# EAGLE design 13+1 Port-Backplane (EAGLE 7.7.0)
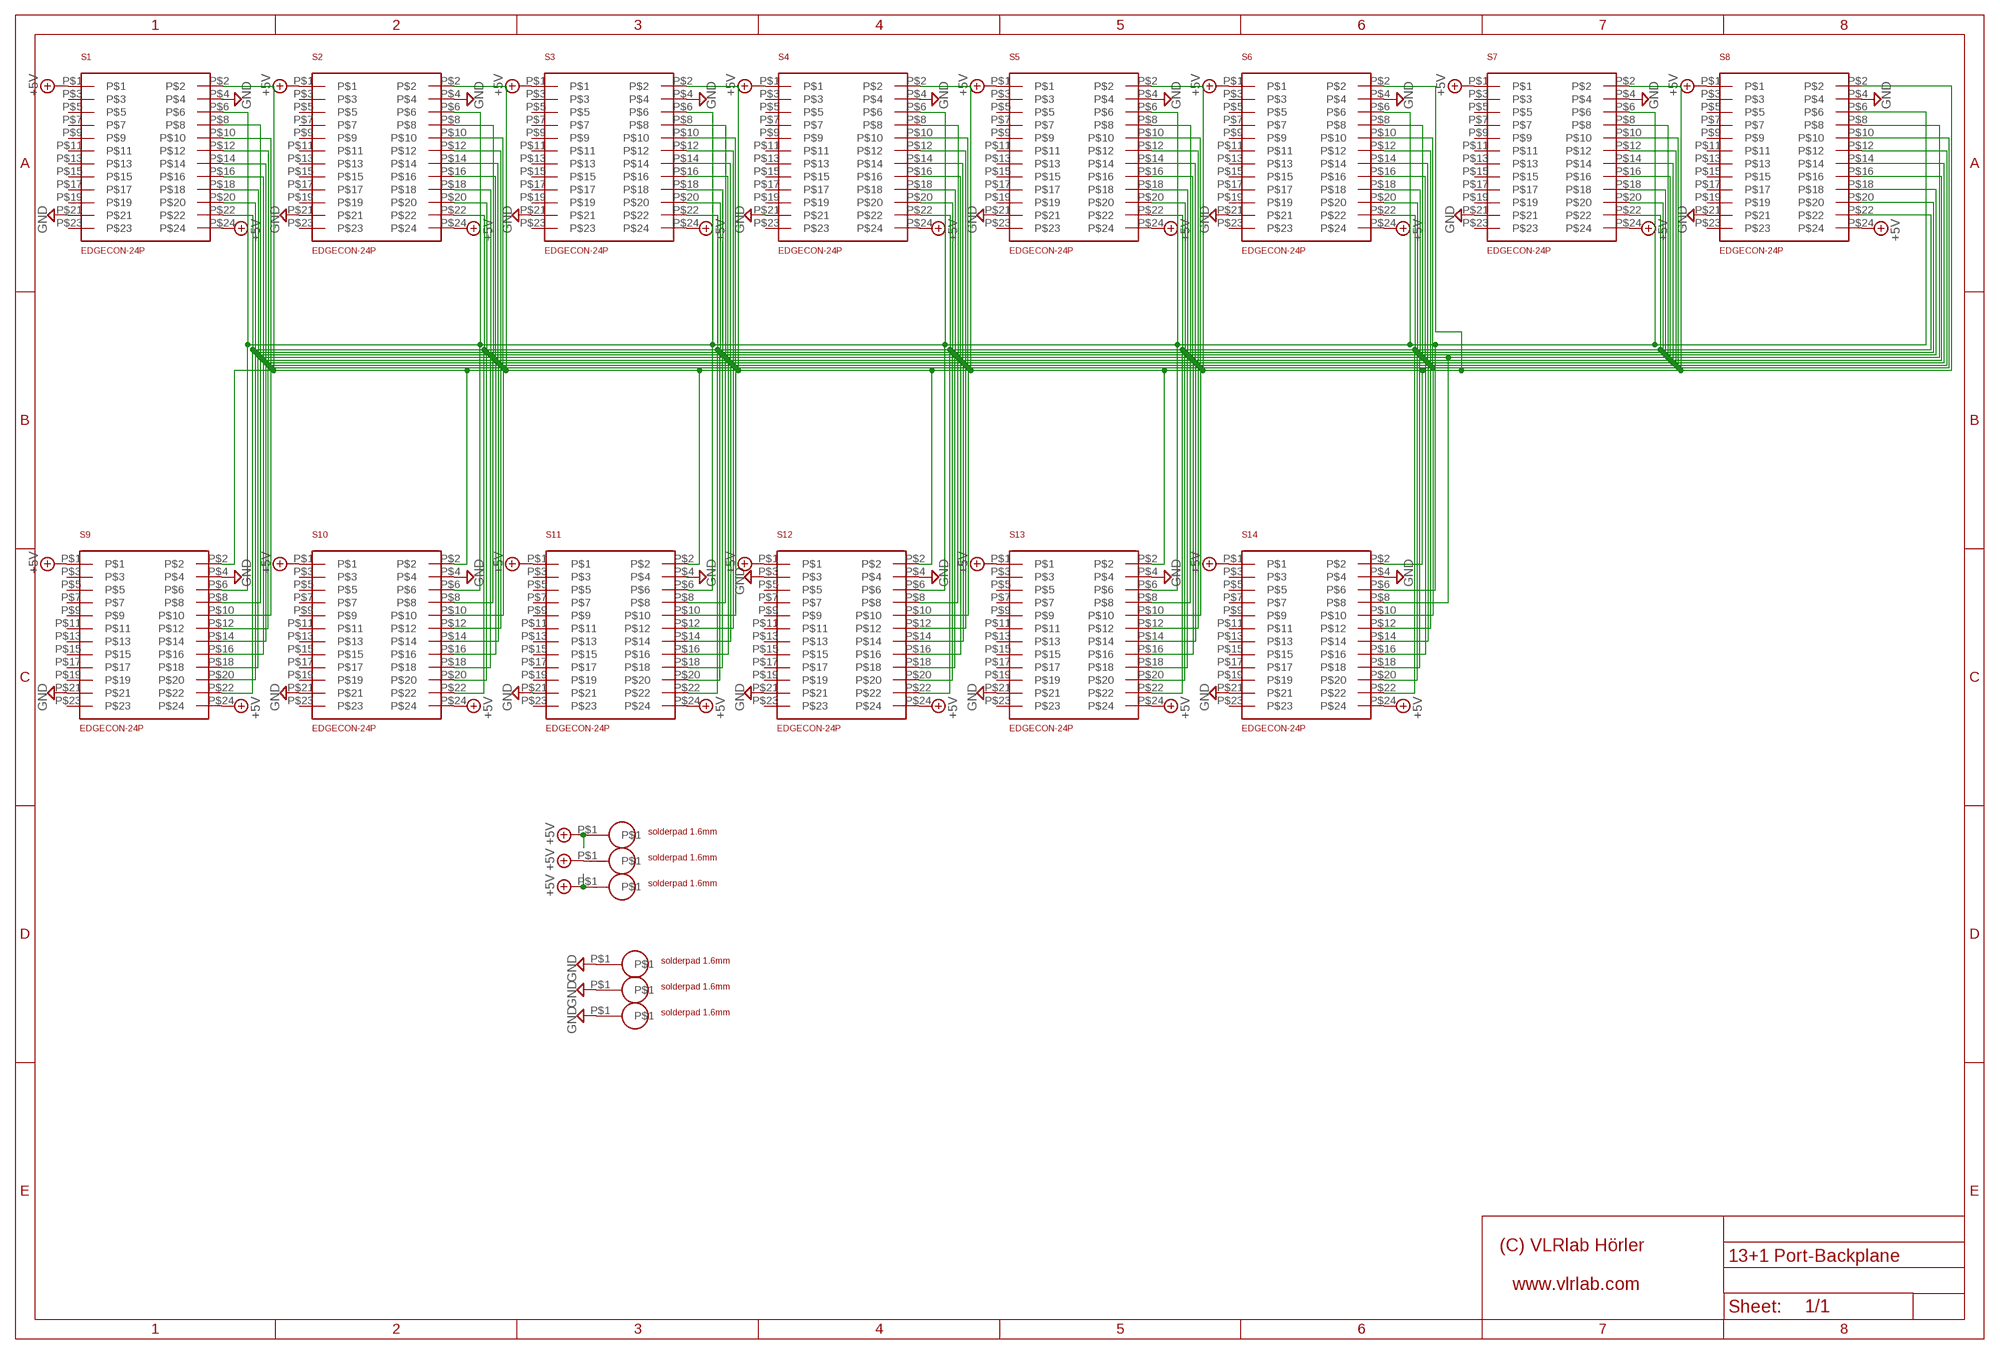
[diagram p0: schematic, sheet 1]

## Parts
S1  EDGECON-24P  [LEDSEE-BOARDCONN24PIN]
S2  EDGECON-24P  [LEDSEE-BOARDCONN24PIN]
S3  EDGECON-24P  [LEDSEE-BOARDCONN24PIN]
S4  EDGECON-24P  [LEDSEE-BOARDCONN24PIN]
S5  EDGECON-24P  [LEDSEE-BOARDCONN24PIN]
S6  EDGECON-24P  [LEDSEE-BOARDCONN24PIN]
S7  EDGECON-24P  [LEDSEE-BOARDCONN24PIN]
S8  EDGECON-24P  [LEDSEE-BOARDCONN24PIN]
S9  EDGECON-24P  [LEDSEE-BOARDCONN24PIN]
S10  EDGECON-24P  [LEDSEE-BOARDCONN24PIN]
S11  EDGECON-24P  [LEDSEE-BOARDCONN24PIN]
S12  EDGECON-24P  [LEDSEE-BOARDCONN24PIN]
S13  EDGECON-24P  [LEDSEE-BOARDCONN24PIN]
S14  EDGECON-24P  [LEDSEE-BOARDCONN24PIN]
U$6  SOLPAD-1,6MM  [SOLDERPAD1.5MM]
U$7  SOLPAD-1,6MM  [SOLDERPAD1.5MM]
U$8  SOLPAD-1,6MM  [SOLDERPAD1.5MM]
U$9  SOLPAD-1,6MM  [SOLDERPAD1.5MM]
U$10  SOLPAD-1,6MM  [SOLDERPAD1.5MM]
U$11  SOLPAD-1,6MM  [SOLDERPAD1.5MM]

## Nets
+5V [+5V]: S1.P$1 S1.P$24 S2.P$1 S2.P$24 S3.P$1 S3.P$24 S4.P$1 S4.P$24 S5.P$1 S5.P$24 S6.P$1 S6.P$24 S7.P$1 S7.P$24 S8.P$1 S8.P$24 S9.P$1 S9.P$24 S10.P$1 S10.P$24 S11.P$1 S11.P$24 S12.P$1 S12.P$24 S13.P$1 S13.P$24 S14.P$1 S14.P$24 U$6.P$1 U$7.P$1 U$9.P$1
GND: S1.P$4 S1.P$21 S2.P$4 S2.P$21 S3.P$4 S3.P$21 S4.P$4 S4.P$21 S5.P$4 S5.P$21 S6.P$4 S6.P$21 S7.P$4 S7.P$21 S8.P$4 S8.P$21 S9.P$4 S9.P$21 S10.P$4 S10.P$21 S11.P$4 S11.P$21 S12.P$3 S12.P$4 S12.P$21 S13.P$4 S13.P$21 S14.P$4 S14.P$21 U$8.P$1 U$10.P$1 U$11.P$1
PIN2: S1.P$2 S2.P$2 S3.P$2 S4.P$2 S5.P$2 S6.P$2 S7.P$2 S8.P$2 S9.P$2 S10.P$2 S11.P$2 S12.P$2 S13.P$2 S14.P$2
PIN6: S1.P$6 S2.P$6 S3.P$6 S4.P$6 S5.P$6 S6.P$6 S7.P$6 S8.P$6 S9.P$6 S10.P$6 S11.P$6 S12.P$6 S13.P$6 S14.P$6
PIN8: S1.P$8 S2.P$8 S3.P$8 S4.P$8 S5.P$8 S6.P$8 S7.P$8 S8.P$8 S9.P$8 S10.P$8 S11.P$8 S12.P$8 S13.P$8 S14.P$8
PIN10: S1.P$10 S2.P$10 S3.P$10 S4.P$10 S5.P$10 S6.P$10 S7.P$10 S8.P$10 S9.P$10 S10.P$10 S11.P$10 S12.P$10 S13.P$10 S14.P$10
PIN12: S1.P$12 S2.P$12 S3.P$12 S4.P$12 S5.P$12 S6.P$12 S7.P$12 S8.P$12 S9.P$12 S10.P$12 S11.P$12 S12.P$12 S13.P$12 S14.P$12
PIN14: S1.P$14 S2.P$14 S3.P$14 S4.P$14 S5.P$14 S6.P$14 S7.P$14 S8.P$14 S9.P$14 S10.P$14 S11.P$14 S12.P$14 S13.P$14 S14.P$14
PIN16: S1.P$16 S2.P$16 S3.P$16 S4.P$16 S5.P$16 S6.P$16 S7.P$16 S8.P$16 S9.P$16 S10.P$16 S11.P$16 S12.P$16 S13.P$16 S14.P$16
PIN18: S1.P$18 S2.P$18 S3.P$18 S4.P$18 S5.P$18 S6.P$18 S7.P$18 S8.P$18 S9.P$18 S10.P$18 S11.P$18 S12.P$18 S13.P$18 S14.P$18
PIN20: S1.P$20 S2.P$20 S3.P$20 S4.P$20 S5.P$20 S6.P$20 S7.P$20 S8.P$20 S9.P$20 S10.P$20 S11.P$20 S12.P$20 S13.P$20 S14.P$20
PIN22: S1.P$22 S2.P$22 S3.P$22 S4.P$22 S5.P$22 S6.P$22 S7.P$22 S8.P$22 S9.P$22 S10.P$22 S11.P$22 S12.P$22 S13.P$22 S14.P$22
Unconnected: S1.P$3 S1.P$5 S1.P$7 S1.P$9 S1.P$11 S1.P$13 S1.P$15 S1.P$17 S1.P$19 S1.P$23 S2.P$3 S2.P$5 S2.P$7 S2.P$9 S2.P$11 S2.P$13 S2.P$15 S2.P$17 S2.P$19 S2.P$23 S3.P$3 S3.P$5 S3.P$7 S3.P$9 S3.P$11 S3.P$13 S3.P$15 S3.P$17 S3.P$19 S3.P$23 S4.P$3 S4.P$5 S4.P$7 S4.P$9 S4.P$11 S4.P$13 S4.P$15 S4.P$17 S4.P$19 S4.P$23 S5.P$3 S5.P$5 S5.P$7 S5.P$9 S5.P$11 S5.P$13 S5.P$15 S5.P$17 S5.P$19 S5.P$23 S6.P$3 S6.P$5 S6.P$7 S6.P$9 S6.P$11 S6.P$13 S6.P$15 S6.P$17 S6.P$19 S6.P$23 S7.P$3 S7.P$5 S7.P$7 S7.P$9 S7.P$11 S7.P$13 S7.P$15 S7.P$17 S7.P$19 S7.P$23 S8.P$3 S8.P$5 S8.P$7 S8.P$9 S8.P$11 S8.P$13 S8.P$15 S8.P$17 S8.P$19 S8.P$23 S9.P$3 S9.P$5 S9.P$7 S9.P$9 S9.P$11 S9.P$13 S9.P$15 S9.P$17 S9.P$19 S9.P$23 S10.P$3 S10.P$5 S10.P$7 S10.P$9 S10.P$11 S10.P$13 S10.P$15 S10.P$17 S10.P$19 S10.P$23 S11.P$3 S11.P$5 S11.P$7 S11.P$9 S11.P$11 S11.P$13 S11.P$15 S11.P$17 S11.P$19 S11.P$23 S12.P$5 S12.P$7 S12.P$9 S12.P$11 S12.P$13 S12.P$15 S12.P$17 S12.P$19 S12.P$23 S13.P$3 S13.P$5 S13.P$7 S13.P$9 S13.P$11 S13.P$13 S13.P$15 S13.P$17 S13.P$19 S13.P$23 S14.P$3 S14.P$5 S14.P$7 S14.P$9 S14.P$11 S14.P$13 S14.P$15 S14.P$17 S14.P$19 S14.P$23

## Library data of the parts
S1-S14 = Ledsee:EDGECON-24P
U$6-U$11 = holes_Ivan:SOLPAD-1,6MM

## Net classes
0 default: width 0.61 mm
1 +5V: width 1.626 mm

## Board
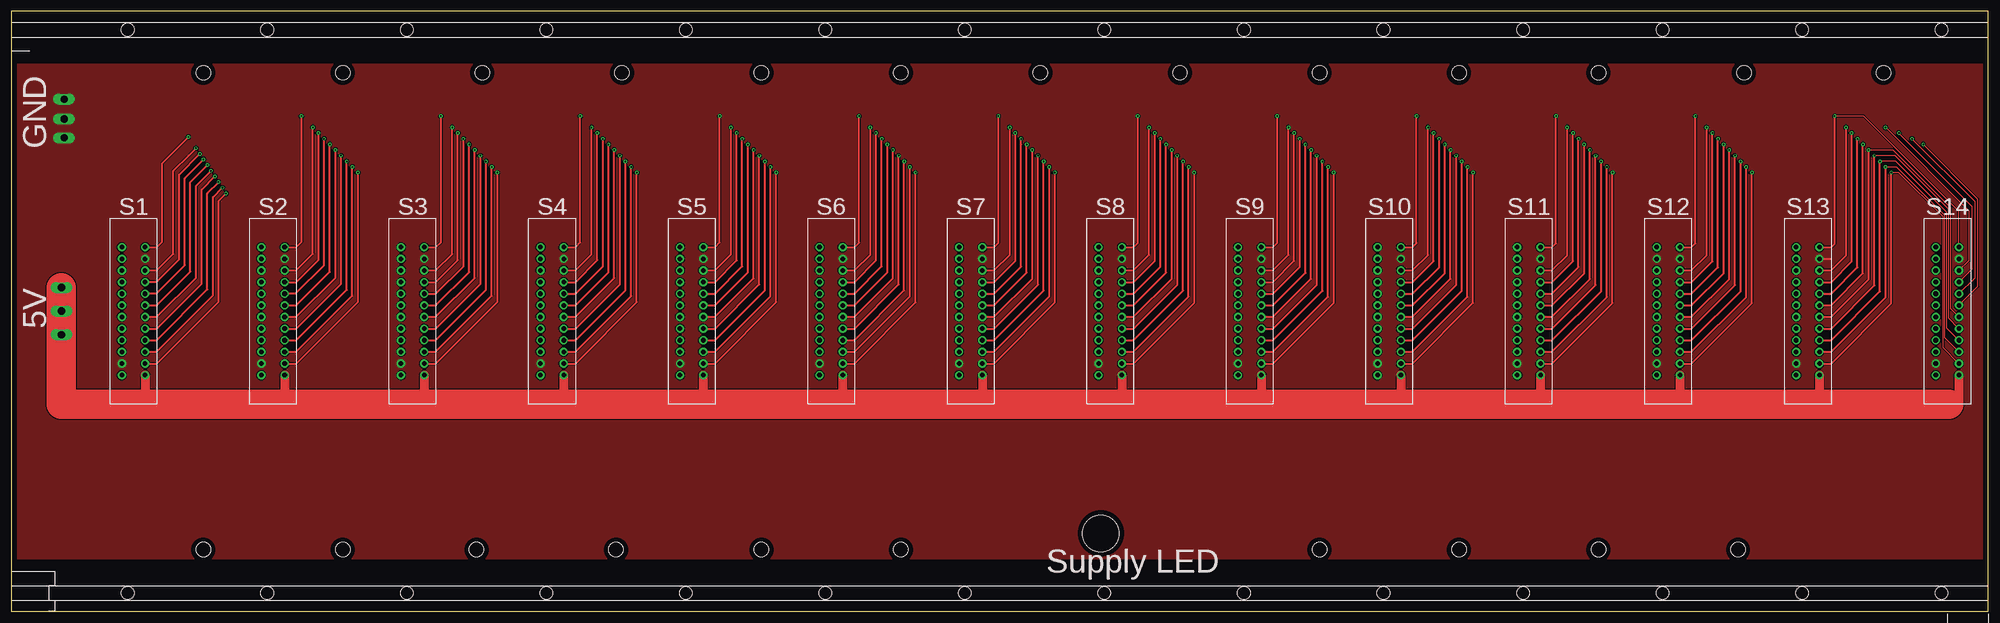
[diagram p1: board, top side]
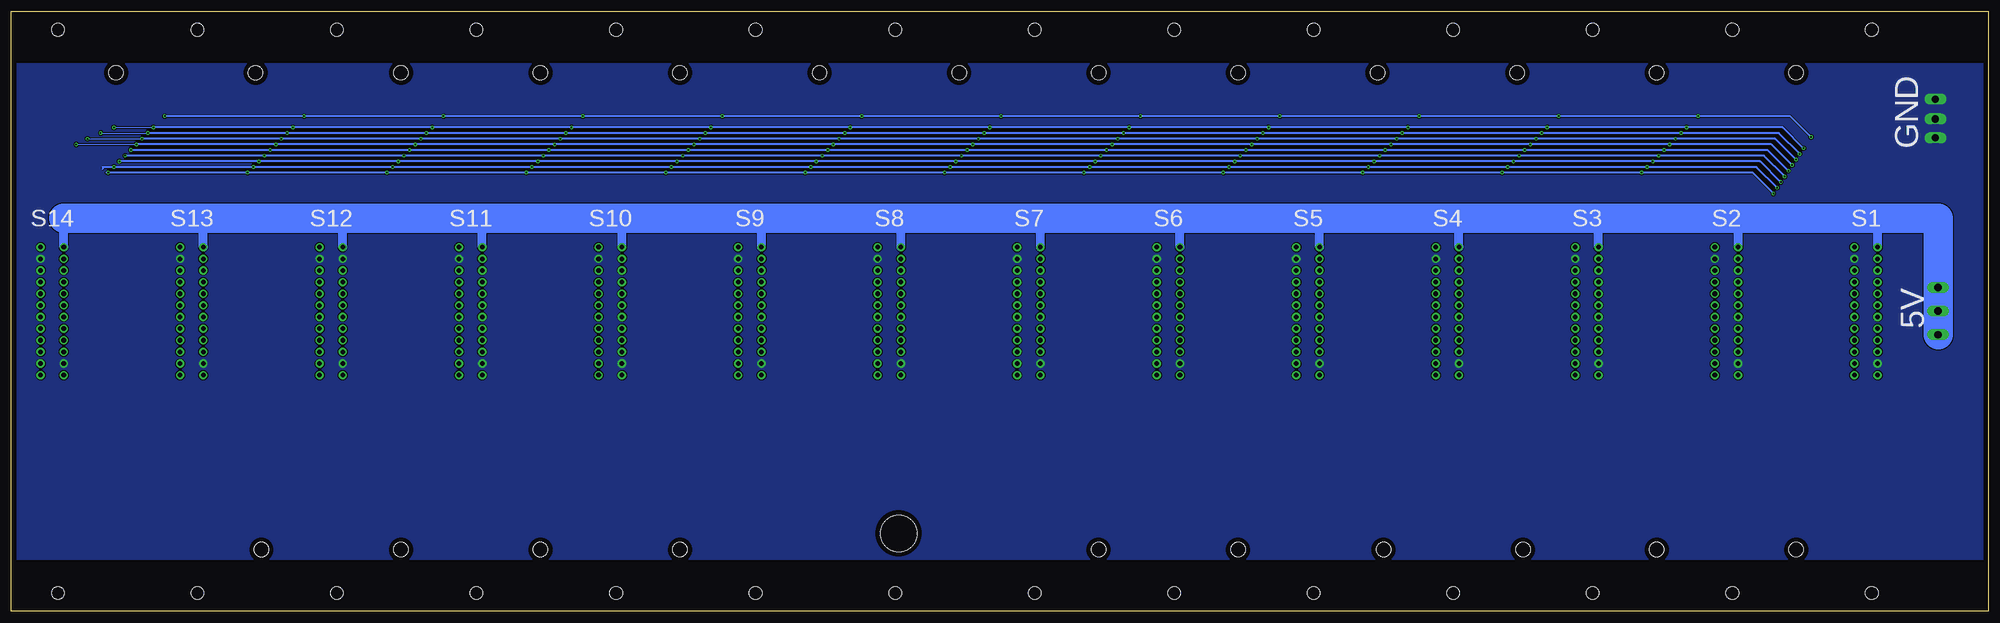
[diagram p2: board, bottom side, seen from below]

Size 431.8 x 131 mm. Coordinates in mm from the lower left corner, seen from the top.
Copper layers (1*16): Top 0.035mm / dielectric 1.5mm / Bottom 0.035mm
Design rules "default *": minimum track width 8mil, minimum drill 24mil, track to track 8mil, track to pad 8mil, pad to pad 8mil, via to via 8mil, smd to smd 8mil, copper to edge 40mil, drill to drill 8mil, minimum pad ring 10mil, minimum via ring 8mil, stop-mask expansion 4mil, vias tented up to drill 0mil, thermal gap 0mil
Holes 8 mm at 238,17
Holes 3.2 mm at 41.91,117.61 72.39,117.61 102.87,117.61 133.35,117.61 163.83,117.61 194.31,117.61 224.79,117.61 255.27,117.61 285.75,117.61 316.23,117.61 346.71,117.61 378.46,117.61 408.94,117.61 377.19,13.47 346.71,13.47 316.23,13.47 285.75,13.47 194.31,13.47 163.83,13.47 132.08,13.47 101.6,13.47 72.39,13.47 41.91,13.47

### Footprints (pad centres in the part's own frame; a part is rotated, then mirrored left to right if it is on the bottom)
LEDSEE-BOARDCONN24PIN = drill 1 pad 1.778: P$1 -2.54,13.97; P$2 2.54,13.97; P$3 -2.54,11.43; P$4 2.54,11.43; P$5 -2.54,8.89; P$6 2.54,8.89; P$7 -2.54,6.35; P$8 2.54,6.35; P$9 -2.54,3.81; P$10 2.54,3.81; P$11 -2.54,1.27; P$12 2.54,1.27; P$13 -2.54,-1.27; P$14 2.54,-1.27; P$15 -2.54,-3.81; P$16 2.54,-3.81; P$17 -2.54,-6.35; P$18 2.54,-6.35; P$19 -2.54,-8.89; P$20 2.54,-8.89; P$21 -2.54,-11.43; P$22 2.54,-11.43; P$23 -2.54,-13.97; P$24 2.54,-13.97
BAUGRUPPENTRAEGERBACKPLANEFULL@1 = hole 2.8: 25.4,127.5; 55.88,127.5; 86.36,127.5; 116.84,127.5; 147.32,127.5; 177.8,127.5; 208.28,127.5; 238.76,127.5; 269.24,127.5; 299.72,127.5; 330.2,127.5; 360.68,127.5; 391.16,127.5; 421.64,127.5; 25.4,4.5; 55.88,4.5; 86.36,4.5; 116.84,4.5; 147.32,4.5; 177.8,4.5; 208.28,4.5; 238.76,4.5; 269.24,4.5; 299.72,4.5; 330.2,4.5; 360.68,4.5; 391.16,4.5; 421.64,4.5
SOLDERPAD1.5MM = drill 1.6 long: P$1 0,0

### Placement (x,y rotation side)
S1  26.67,65.54 0 top
S2  57.15,65.54 0 top
S3  87.63,65.54 0 top
S4  118.11,65.54 0 top
S5  148.59,65.54 0 top
S6  179.07,65.54 0 top
S7  209.55,65.54 0 top
S8  240.03,65.54 0 top
S9  270.51,65.54 0 top
S10  300.99,65.54 0 top
S11  331.47,65.54 0 top
S12  361.95,65.54 0 top
S13  392.43,65.54 0 top
S14  422.91,65.54 0 top
U$2  [BAUGRUPPENTRAEGERBACKPLANEFULL@1]  0,-0.5 0 top
U$3  [VLRLAB]  401.32,13.47 0 top
U$4  [VLRLAB]  414.02,13.47 0 bottom
U$5  [BACKPLANE]  221.75,33.92 0 bottom
U$6  10.9,60.4 0 top
U$7  10.9,70.69 0 top
U$8  11.52,103.4 0 top
U$9  10.9,65.54 0 top
U$10  11.52,107.51 0 top
U$11  11.52,111.83 0 top
U$12  [BACKPLANE]  221.75,33.92 0 top

### Tracks (layer width: path | path; a pad name or v marks a point on that pad's centre or on a via)
+5V
  Top 1.93: 24.13,45.22 23.88,45.22 | S1.P$24 29.21,45.22 | S2.P$24 59.69,45.22 | S3.P$24 90.17,45.22 | S4.P$24 120.65,45.22 | S5.P$24 151.13,45.22 | S6.P$24 181.61,45.22 | S7.P$24 212.09,45.22 | S8.P$24 242.57,45.22 | S9.P$24 273.05,45.22 | S10.P$24 303.53,45.22 | S11.P$24 334.01,45.22 | S12.P$24 364.49,45.22 | S13.P$24 394.97,45.22 | S14.P$24 425.45,45.22 423.16,45.22
  Top 6.452: 23.88,45.22 24.13,45.22 | 24.13,45.22 29.21,45.22 54.61,45.22 59.69,45.22 85.09,45.22 90.17,45.22 115.57,45.22 120.65,45.22 146.05,45.22 151.13,45.22 176.53,45.22 181.61,45.22 207.01,45.22 212.09,45.22 237.49,45.22 242.57,45.22 267.97,45.22 273.05,45.22 298.45,45.22 303.53,45.22 328.93,45.22 334.01,45.22 359.41,45.22 364.49,45.22 389.89,45.22 394.97,45.22 420.37,45.22 423.16,45.22 | 24.13,45.22 23.88,45.22 | 23.88,45.22 10.84,45.22 10.9,45.22 U$6.P$1 | U$6.P$1 U$9.P$1 | U$9.P$1 10.9,69.86 | 10.9,69.86 U$7.P$1 | 10.9,69.86 U$9.P$1 | U$6.P$1 U$9.P$1
  Bottom 1.93: 419.87,85.86 419.89,85.86 | S14.P$1 420.37,85.86 | S13.P$1 389.89,85.86 | S12.P$1 359.41,85.86 | S11.P$1 328.93,85.86 | S10.P$1 298.45,85.86 | S9.P$1 267.97,85.86 | 242.57,85.35 242.57,85.86 | S8.P$1 237.49,85.86 | S7.P$1 207.01,85.86 | S6.P$1 176.53,85.86 | S5.P$1 146.05,85.86 | S4.P$1 115.57,85.86 | S3.P$1 85.09,85.86 | S2.P$1 54.61,85.86 | S1.P$1 24.13,85.86 26.42,85.86
  Bottom 6.452: 26.42,85.86 26.92,85.86 | 26.92,85.86 29.21,85.86 54.61,85.86 59.69,85.86 85.09,85.86 90.17,85.86 115.57,85.86 120.65,85.86 146.05,85.86 151.13,85.86 176.53,85.86 181.61,85.86 207.01,85.86 212.09,85.86 237.49,85.86 242.57,85.86 267.97,85.86 273.05,85.86 298.45,85.86 303.53,85.86 328.93,85.86 334.01,85.86 359.41,85.86 364.49,85.86 389.89,85.86 394.97,85.86 419.87,85.86 | 419.87,85.86 419.89,85.86 | 419.89,85.86 420.37,85.86 419.89,85.86 | 419.89,85.86 419.87,85.86 | 26.92,85.86 10.84,85.86 10.9,85.86 U$6.P$1
GND
  Top 0.406: S13.P$4 397.51,76.97
  pour Top: 1,11.5 1,119.5 431,119.5 431,11.5
  pour Bottom: 1,11.5 1,119.5 431,119.5 431,11.5
PIN2  (via drill 0.33)
  Top 0.203: S14.P$2 425.45,87.37 404.69,108.13 v398.31,108.13
  Top 0.406: S1.P$2 31.75,79.51 32.92,80.68 32.92,97.84 v38.68,103.6 | S2.P$2 62.23,79.51 63.37,80.65 v63.37,108.13 | S3.P$2 92.71,79.51 93.82,80.62 v93.82,108.13 | S4.P$2 123.19,79.51 124.27,80.59 v124.27,108.13 | S5.P$2 153.67,79.51 154.72,80.56 v154.72,108.13 | S6.P$2 184.15,79.51 185.17,80.53 v185.17,108.13 | S7.P$2 214.63,79.51 215.62,80.5 v215.62,108.13 | S8.P$2 245.11,79.51 246.06,80.47 v246.06,108.13 | S9.P$2 275.59,79.51 276.51,80.44 v276.51,108.13 | S10.P$2 306.07,79.51 306.96,80.4 v306.96,108.13 | S11.P$2 336.55,79.51 337.41,80.37 v337.41,108.13 | S12.P$2 367.03,79.51 367.86,80.34 v367.86,108.13 | S13.P$2 397.51,79.51 398.31,80.31 v398.31,108.13
  Bottom 0.406: v38.68,103.6 43.2,108.13 v63.37,108.13 v93.82,108.13 v124.27,108.13 v154.72,108.13 v185.17,108.13 v215.62,108.13 v246.06,108.13 v276.51,108.13 v306.96,108.13 v337.41,108.13 v367.86,108.13 v398.31,108.13
PIN6  (via drill 0.33)
  Top 0.203: S14.P$6 427.73,76.71 427.73,87.35 v409.42,105.66 | v409.42,105.66
  Top 0.406: S1.P$6 31.75,74.43 35.39,78.07 35.39,96.2 38.68,99.49 | S2.P$6 62.23,74.43 65.84,78.04 v65.84,105.66 | S3.P$6 92.71,74.43 96.29,78.01 v96.29,105.66 | S4.P$6 123.19,74.43 126.74,77.98 v126.74,105.66 | S5.P$6 153.67,74.43 157.19,77.94 v157.19,105.66 | S6.P$6 184.15,74.43 187.63,77.92 v187.63,105.66 | S7.P$6 214.63,74.43 218.08,77.88 v218.08,105.66 | S8.P$6 245.11,74.43 248.53,77.85 v248.53,105.66 | S9.P$6 275.59,74.43 278.98,77.82 v278.98,105.66 | S10.P$6 306.07,74.43 309.43,77.79 v309.43,105.66 | S11.P$6 336.55,74.43 339.88,77.76 v339.88,105.66 | S12.P$6 367.03,74.43 370.33,77.73 v370.33,105.66 | S13.P$6 397.51,74.43 400.78,77.7 v400.78,105.66 | 38.68,99.49 | 38.68,99.49 v40.33,101.14
  Bottom 0.203: v409.42,105.66 v400.78,105.66
  Bottom 0.406: v40.33,101.14 | v40.33,101.14 44.85,105.66 v65.84,105.66 v96.29,105.66 v126.74,105.66 v157.19,105.66 v187.63,105.66 v218.08,105.66 v248.53,105.66 v278.98,105.66 v309.43,105.66 v339.88,105.66 v370.33,105.66 v400.78,105.66
PIN8  (via drill 0.33)
  Top 0.203: S14.P$8 428.35,74.79 428.35,88.38 v412.3,104.43 | v412.3,104.43
  Top 0.406: S10.P$8 306.07,71.89 310.67,76.49 v310.67,104.43 | S1.P$8 29.24,71.92 31.68,71.92 36.62,76.86 36.62,95.38 | 36.62,95.38 | 36.62,95.38 v41.15,99.9 | S2.P$8 62.23,71.89 67.07,76.73 v67.07,104.43 | S3.P$8 92.71,71.89 97.52,76.7 v97.52,104.43 | S4.P$8 123.19,71.89 127.97,76.67 v127.97,104.43 | S5.P$8 153.67,71.89 158.42,76.64 v158.42,104.43 | S6.P$8 184.15,71.89 188.87,76.61 v188.87,104.43 | S7.P$8 214.63,71.89 219.32,76.58 v219.32,104.43 | S8.P$8 245.11,71.89 249.77,76.55 v249.77,104.43 | S9.P$8 275.59,71.89 280.22,76.52 v280.22,104.43 | S11.P$8 336.55,71.89 341.12,76.46 v341.12,104.43 | S12.P$8 367.03,71.89 371.57,76.43 v371.57,104.43 | S13.P$8 397.51,71.89 402.02,76.4 v402.02,104.43
  Bottom 0.203: v412.3,104.43 v402.02,104.43
  Bottom 0.406: v41.15,99.9 45.67,104.43 v67.07,104.43 v97.52,104.43 v127.97,104.43 v158.42,104.43 v188.87,104.43 v219.32,104.43 v249.77,104.43 v280.22,104.43 v310.67,104.43 v341.12,104.43 v371.57,104.43 v402.02,104.43
PIN10  (via drill 0.33)
  Top 0.203: S14.P$10 428.97,72.87 428.97,89.41 v415.18,103.19
  Top 0.406: S1.P$10 29.31,69.45 31.68,69.45 37.86,75.62 37.86,94.55 v41.97,98.67 | S2.P$10 59.79,69.45 62.13,69.45 68.31,75.62 v68.31,103.19 | S3.P$10 92.71,69.35 98.75,75.39 v98.75,103.19 | S4.P$10 123.19,69.35 129.21,75.36 129.21,101.96 v129.21,103.19 | S5.P$10 153.67,69.35 159.65,75.33 v159.65,103.19 | S6.P$10 184.15,69.35 190.1,75.3 v190.1,103.19 | S7.P$10 214.63,69.35 220.55,75.27 220.55,101.96 v220.55,103.19 | S8.P$10 245.11,69.35 251,75.24 v251,103.19 | S9.P$10 275.59,69.35 281.45,75.21 v281.45,103.19 | S10.P$10 306.07,69.35 311.9,75.18 v311.9,103.19 | S11.P$10 336.55,69.35 342.35,75.15 v342.35,103.19 | S12.P$10 367.03,69.35 372.8,75.12 v372.8,103.19 | S13.P$10 397.51,69.35 403.25,75.09 v403.25,103.19
  Bottom 0.203: v415.18,103.19 v403.25,103.19
  Bottom 0.406: v41.97,98.67 | v41.97,98.67 46.5,103.19 v68.31,103.19 v98.75,103.19 v129.21,103.19 v159.65,103.19 v190.1,103.19 v220.55,103.19 v251,103.19 v281.45,103.19 v311.9,103.19 v342.35,103.19 v372.8,103.19 v403.25,103.19
PIN12  (via drill 0.33)
  Top 0.203: S14.P$12 429.58,70.94 429.58,90.03 v417.65,101.96
  Top 0.406: S1.P$12 31.75,66.81 39.09,74.15 39.09,93.73 v42.79,97.43 | S2.P$12 62.23,66.81 69.54,74.12 v69.54,101.96 | S3.P$12 92.71,66.81 99.99,74.09 v99.99,101.96 | S4.P$12 123.19,66.81 130.44,74.06 v130.44,101.96 | S5.P$12 153.67,66.81 160.89,74.03 v160.89,101.96 | S6.P$12 184.15,66.81 191.34,74 v191.34,101.96 | S8.P$12 245.11,66.81 252.24,73.94 v252.24,101.96 | S9.P$12 275.59,66.81 282.69,73.91 v282.69,101.96 | S10.P$12 306.07,66.81 313.14,73.88 v313.14,101.96 | S11.P$12 336.55,66.81 343.59,73.85 v343.59,101.96 | S12.P$12 367.03,66.81 374.04,73.81 v374.04,101.96 | S13.P$12 397.51,66.81 404.49,73.78 v404.49,101.96 | S7.P$12 214.63,66.81 221.79,73.97 v221.79,101.96
  Bottom 0.203: v417.65,101.96 v404.49,101.96
  Bottom 0.406: v42.79,97.43 47.32,101.96 v69.54,101.96 v99.99,101.96 v130.44,101.96 v160.89,101.96 v191.34,101.96 v221.79,101.96 v252.24,101.96 v282.69,101.96 v313.14,101.96 v343.59,101.96 v374.04,101.96 v404.49,101.96
PIN14  (via drill 0.33)
  Top 0.203: S14.P$14 423.62,66.1 | 423.62,66.1 423.62,80.77 | 423.62,66.1 423.62,88.17 411.07,100.72 v405.72,100.72
  Top 0.406: S1.P$14 31.75,64.27 40.33,72.84 40.33,92.91 | 40.33,92.91 | 40.33,92.91 v43.62,96.2 | S2.P$14 62.23,64.27 70.78,72.81 v70.78,100.72 | S3.P$14 92.71,64.27 101.22,72.78 v101.22,100.72 | S4.P$14 123.19,64.27 131.67,72.75 v131.67,100.72 | S5.P$14 153.67,64.27 162.12,72.72 v162.12,100.72 | S6.P$14 184.15,64.27 192.57,72.69 v192.57,100.72 | S7.P$14 214.63,64.27 223.02,72.66 v223.02,100.72 | S8.P$14 245.11,64.27 253.47,72.63 v253.47,100.72 | S9.P$14 275.59,64.27 283.92,72.6 v283.92,100.72 | S10.P$14 306.07,64.27 314.37,72.57 v314.37,100.72 | S11.P$14 336.55,64.27 344.82,72.54 v344.82,100.72 | S12.P$14 367.03,64.27 375.27,72.51 v375.27,100.72 | S13.P$14 397.51,64.27 405.72,72.48 v405.72,100.72
  Bottom 0.406: v43.62,96.2 48.14,100.72 v70.78,100.72 v101.22,100.72 v131.67,100.72 v162.12,100.72 v192.57,100.72 v223.02,100.72 v253.47,100.72 v283.92,100.72 v314.37,100.72 v344.82,100.72 v375.27,100.72 v405.72,100.72
PIN16  (via drill 0.33)
  Top 0.203: S14.P$16 423.21,63.97 | 423.21,63.97 423.21,80.77 | 423.21,63.97 423.21,87.76 411.48,99.49 v406.95,99.49
  Top 0.406: S1.P$16 31.75,61.73 41.56,71.54 41.56,92.08 v44.44,94.96 | S2.P$16 62.23,61.73 72.01,71.51 v72.01,99.49 | S3.P$16 92.71,61.73 102.46,71.48 v102.46,99.49 | S4.P$16 123.19,61.73 132.91,71.45 v132.91,99.49 | S5.P$16 153.67,61.73 163.36,71.42 v163.36,99.49 | S6.P$16 184.15,61.73 193.81,71.39 v193.81,99.49 | S7.P$16 214.63,61.73 224.26,71.36 v224.26,99.49 | S8.P$16 245.11,61.73 254.71,71.33 v254.71,99.49 | S9.P$16 275.59,61.73 285.16,71.3 v285.16,99.49 | 306.07,61.73 S10.P$16 306.07,61.73 | S11.P$16 336.55,61.73 346.06,71.23 v346.06,99.49 | S12.P$16 367.03,61.73 376.5,71.2 v376.5,99.49 | S13.P$16 397.51,61.73 406.95,71.17 v406.95,99.49 | 306.07,61.73 315.61,71.27 v315.61,99.49
  Bottom 0.406: v44.44,94.96 48.97,99.49 v72.01,99.49 v102.46,99.49 v132.91,99.49 v163.36,99.49 v193.81,99.49 v224.26,99.49 v254.71,99.49 v285.16,99.49 v315.61,99.49 v346.06,99.49 v376.5,99.49 v406.95,99.49
PIN18  (via drill 0.33)
  Top 0.203: S14.P$18 422.8,61.84 | 422.8,61.84 422.8,80.77 | 422.8,61.84 422.8,87.14 411.69,98.25 v408.19,98.25
  Top 0.406: S1.P$18 29.23,59.16 31.68,59.16 42.79,70.28 42.79,91.26 | 42.79,91.26 | 42.79,91.26 | 42.79,91.26 v45.26,93.73 | S2.P$18 62.23,59.19 73.24,70.2 v73.24,98.25 | S3.P$18 92.71,59.19 103.69,70.17 v103.69,98.25 | S4.P$18 123.19,59.19 134.14,70.14 v134.14,98.25 | S5.P$18 153.67,59.19 164.59,70.11 v164.59,98.25 | S6.P$18 184.15,59.19 195.04,70.08 v195.04,98.25 | S7.P$18 214.63,59.19 225.49,70.05 v225.49,98.25 | S8.P$18 245.11,59.19 255.94,70.02 v255.94,98.25 | S9.P$18 275.59,59.19 286.39,69.99 v286.39,98.25 | S10.P$18 306.07,59.19 316.84,69.96 v316.84,98.25 | S11.P$18 336.55,59.19 347.29,69.93 v347.29,98.25 | S12.P$18 367.03,59.19 377.74,69.9 v377.74,98.25 | S13.P$18 397.51,59.19 408.19,69.87 v408.19,98.25
  Bottom 0.406: v45.26,93.73 49.79,98.25 v73.24,98.25 v103.69,98.25 v134.14,98.25 v164.59,98.25 v195.04,98.25 v225.49,98.25 v255.94,98.25 v286.39,98.25 v316.84,98.25 v347.29,98.25 v377.74,98.25 v408.19,98.25
PIN20  (via drill 0.33)
  Top 0.203: S14.P$20 422.38,59.72 | 422.38,59.72 422.38,80.77 | 422.38,59.72 422.38,86.53 411.89,97.02 v409.42,97.02
  Top 0.406: S1.P$20 29.26,56.7 31.68,56.7 44.03,69.04 44.03,90.44 v46.09,92.49 | S2.P$20 62.23,56.65 74.48,68.9 v74.48,97.02 | S3.P$20 92.71,56.65 104.93,68.87 v104.93,97.02 | S4.P$20 123.19,56.65 135.38,68.84 v135.38,97.02 | S5.P$20 153.67,56.65 165.83,68.81 v165.83,97.02 | S6.P$20 184.15,56.65 196.28,68.78 v196.28,97.02 | S7.P$20 214.63,56.65 226.72,68.75 v226.72,97.02 | S8.P$20 245.11,56.65 257.18,68.72 v257.18,97.02 | S9.P$20 275.59,56.65 287.62,68.69 v287.62,97.02 | S10.P$20 306.07,56.65 318.07,68.65 v318.07,97.02 | 336.55,56.65 S11.P$20 336.55,56.65 | S12.P$20 367.03,56.65 378.97,68.59 v378.97,97.02 | S13.P$20 397.51,56.65 409.42,68.56 v409.42,97.02 | 336.55,56.65 348.52,68.62 v348.52,97.02
  Bottom 0.406: v46.09,92.49 50.61,97.02 v74.48,97.02 v104.93,97.02 v135.38,97.02 v165.83,97.02 v196.28,97.02 v226.72,97.02 v257.18,97.02 v287.62,97.02 v318.07,97.02 v348.52,97.02 v378.97,97.02 v409.42,97.02 411.89,97.02 411.89,96.61
PIN22  (via drill 0.33)
  Top 0.203: S14.P$22 421.97,57.59 | 421.97,57.59 421.97,80.77 | 421.97,57.59 421.97,80.77 | 421.97,80.77 421.97,86.12 412.3,95.79 v410.66,95.79
  Top 0.406: S1.P$22 31.75,54.11 45.26,67.62 45.26,89.61 v46.91,91.26 | v46.91,91.26 | S2.P$22 62.23,54.11 75.71,67.59 v75.71,95.79 | S3.P$22 92.71,54.11 106.16,67.56 v106.16,95.79 | S4.P$22 123.19,54.11 136.61,67.53 v136.61,95.79 | S5.P$22 153.67,54.11 167.06,67.5 v167.06,95.79 | S6.P$22 184.15,54.11 197.51,67.47 v197.51,95.79 | S7.P$22 214.63,54.11 227.96,67.44 v227.96,95.79 | S8.P$22 245.11,54.11 258.41,67.41 v258.41,95.79 | S9.P$22 275.59,54.11 288.86,67.38 v288.86,95.79 | S10.P$22 306.07,54.11 319.31,67.35 v319.31,95.79 | S11.P$22 336.55,54.11 349.76,67.32 v349.76,95.79 | S13.P$22 397.51,54.11 410.66,67.26 v410.66,95.79 | S12.P$22 367.03,54.11 380.21,67.29 v380.21,95.79
  Bottom 0.406: v46.91,91.26 51.44,95.79 v75.71,95.79 v106.16,95.79 v136.61,95.79 v167.06,95.79 v197.51,95.79 v227.96,95.79 v258.41,95.79 v288.86,95.79 v319.31,95.79 v349.76,95.79 v380.21,95.79 v410.66,95.79 411.07,95.79

### Text on the board
tNames: GND | 5V | Supply LED
bNames: GND | 5V
tDocu: 16,2mil routing grid